# EAGLE schematic big-muff (EAGLE 9.6.2)
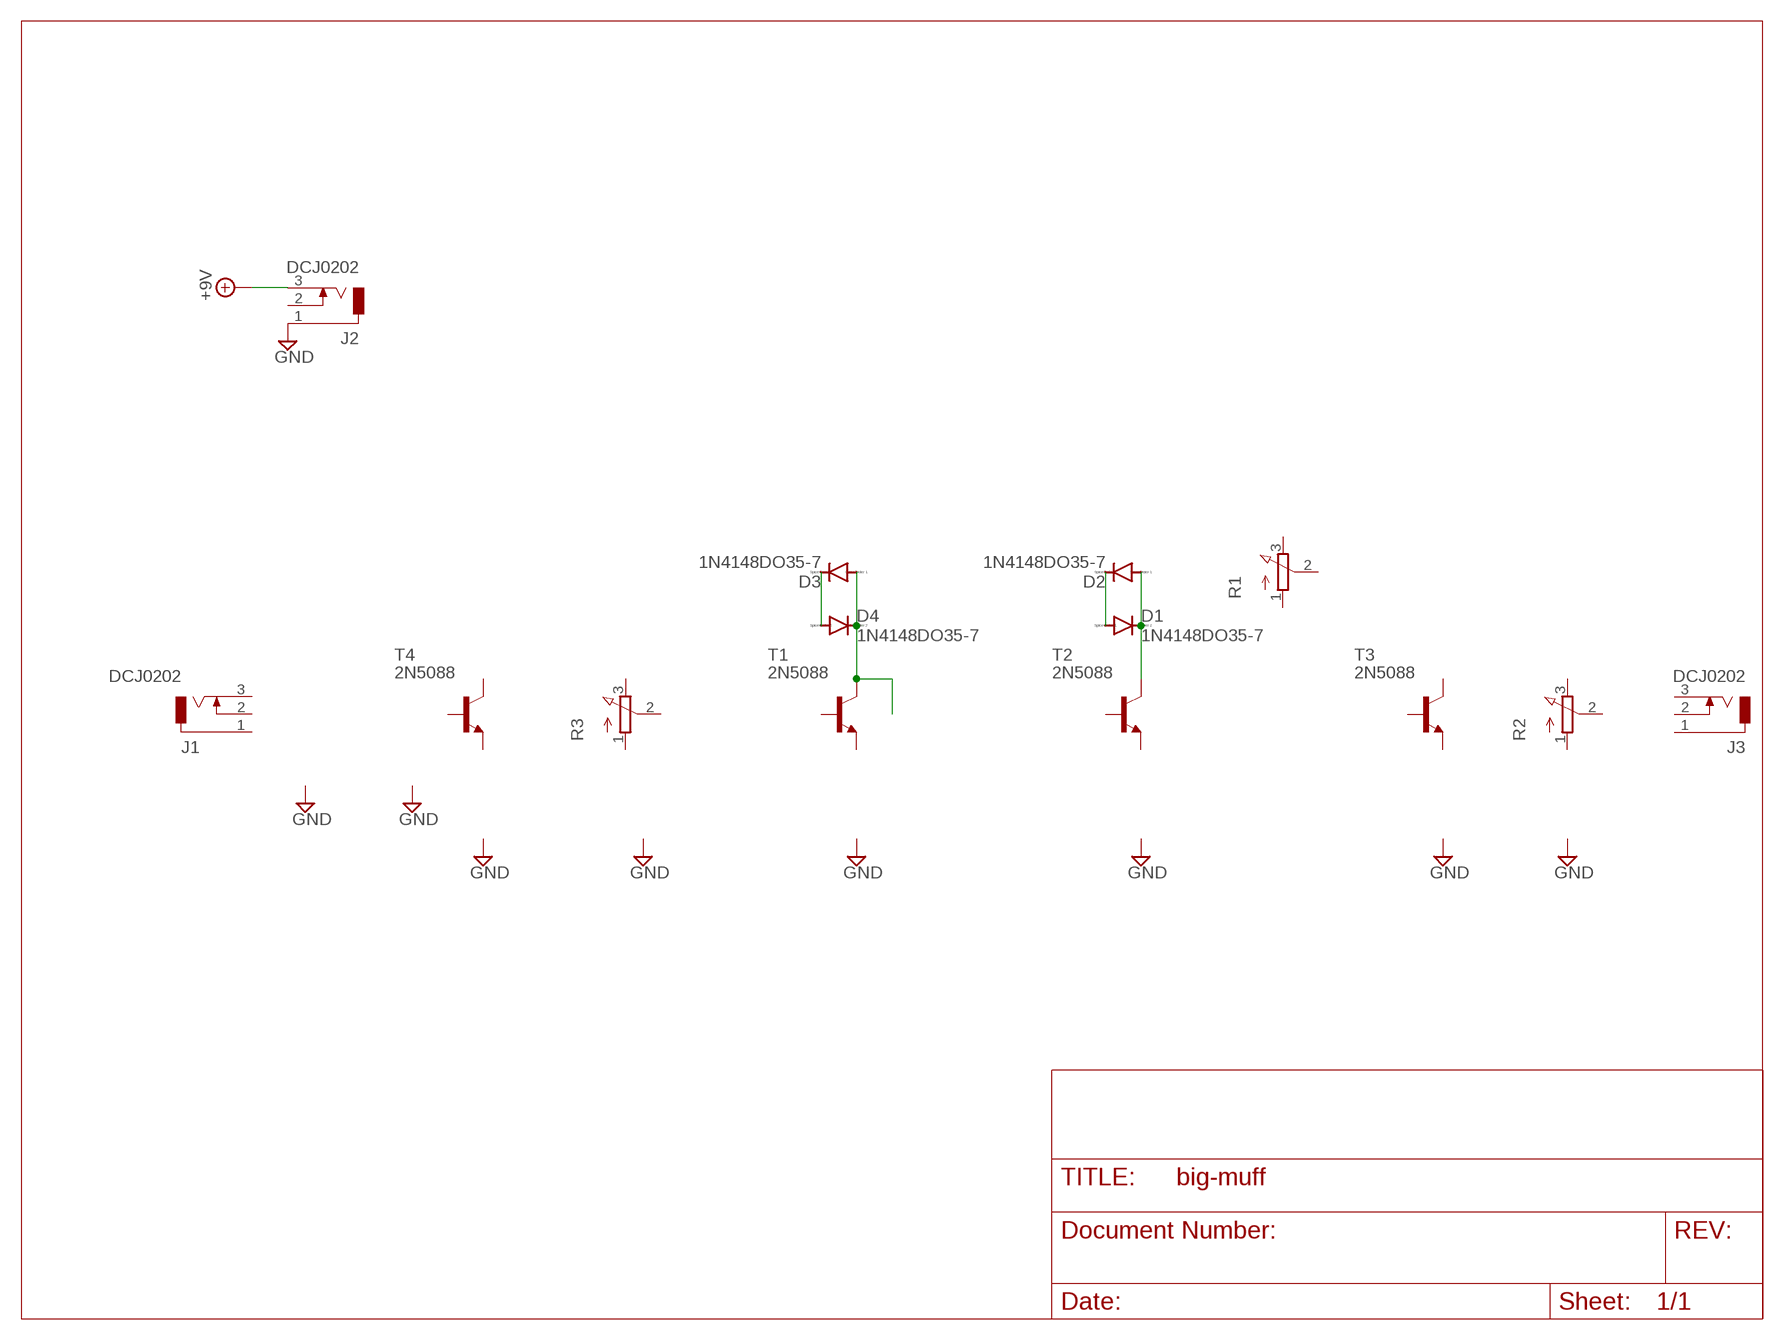
[diagram p0: schematic, sheet 1]

## Parts
D1  1N4148DO35-7  [DO35-7]
D2  1N4148DO35-7  [DO35-7]
D3  1N4148DO35-7  [DO35-7]
D4  1N4148DO35-7  [DO35-7]
J1  DCJ0202  [DCJ0202]
J2  DCJ0202  [DCJ0202]
J3  DCJ0202  [DCJ0202]
R1  3RP/1610N  [3RP/1610N]
R2  3RP/1610N  [3RP/1610N]
R3  3RP/1610N  [3RP/1610N]
T1  2N5088  [TO92]
T2  2N5088  [TO92]
T3  2N5088  [TO92]
T4  2N5088  [TO92]

## Nets
+9V: J2.3
GND: J2.1
N$1: D3.A D4.C T1.1(C)
N$2: D3.C D4.A
N$3: D1.A D2.C
N$4: D1.C D2.A T2.1(C)
Unconnected: J1.1 J1.2 J1.3 J2.2 J3.1 J3.2 J3.3 R1.1(A) R1.2(S) R1.3(E) R2.1(A) R2.2(S) R2.3(E) R3.1(A) R3.2(S) R3.3(E) T1.2(B) T1.3(E) T2.2(B) T2.3(E) T3.1(C) T3.2(B) T3.3(E) T4.1(C) T4.2(B) T4.3(E)

## Library data of the parts
D1-D4 = diode:1N4148: DIODE high speed (Philips)
J1-J3 = con-jack:DCJ0202: DC POWER JACK Source: DCJ0202.pdf; OC_FARNELL: unknown; OC_NEWARK: unknown
R1-R3 = pot:3RP/1610N: 16mm Potentiometer one level Source: http://www.alphapotentiometers.net/html/16mm_pot_2.html
T1-T4 = transistor:2N5088: NPN TRANSISTOR